# Altium schematic sheet 04_Part-2.SchDoc
size A3; SheetNumber: 4; SheetTotal: 5
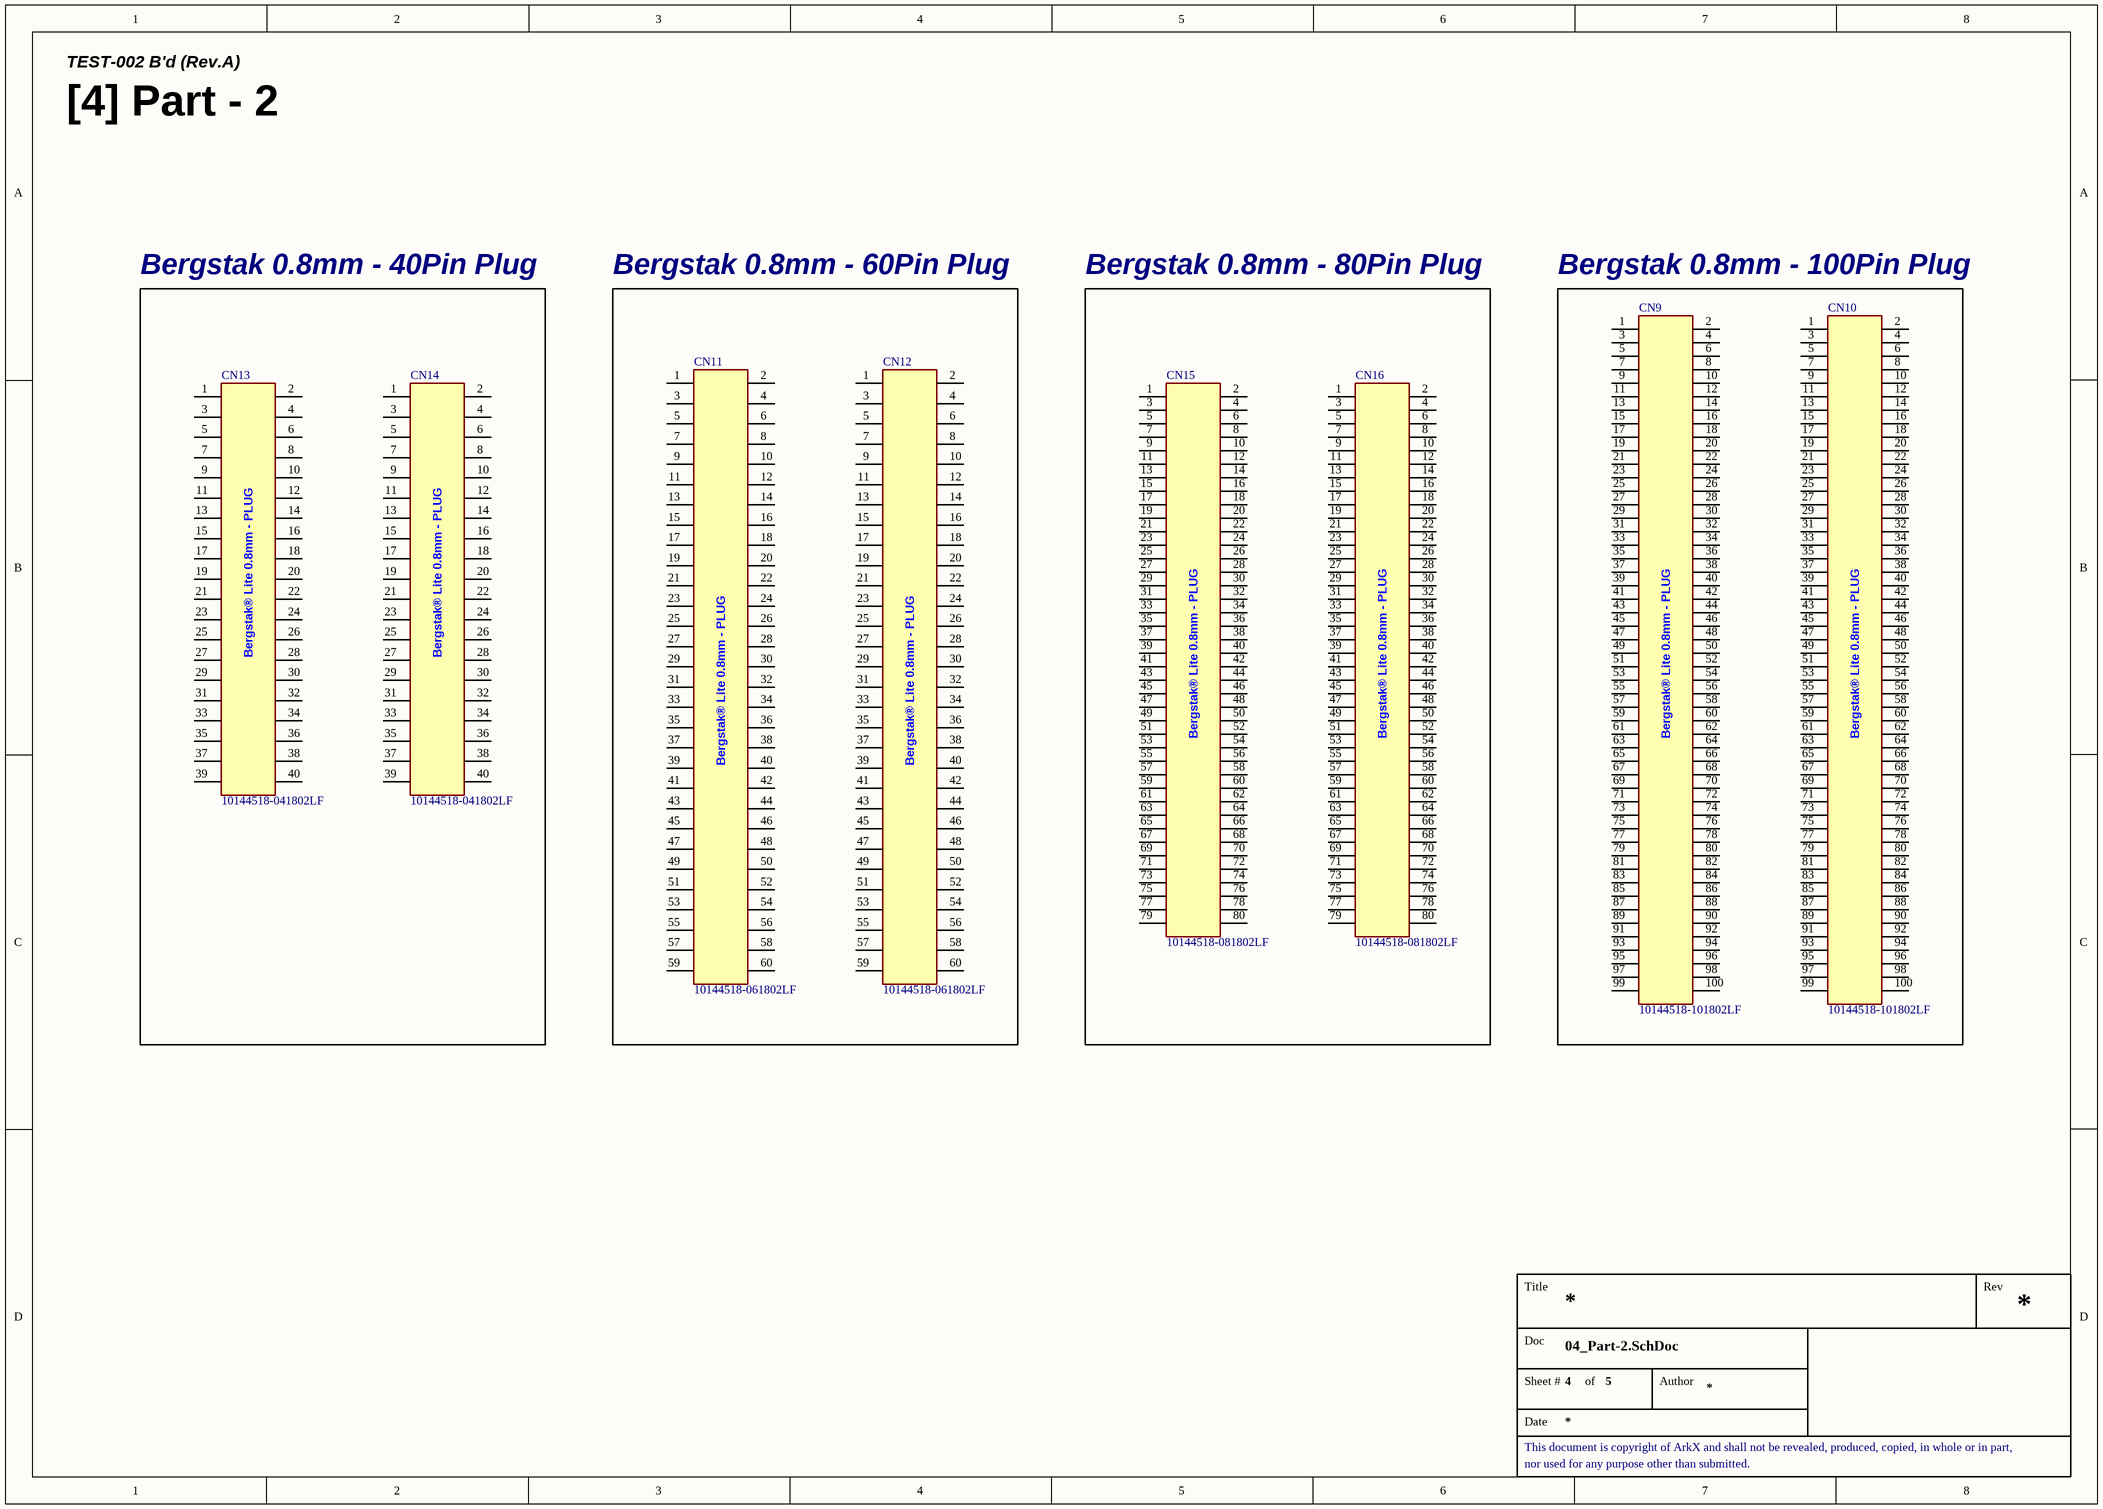
[diagram p0: 04_Part-2.SchDoc]

## Parts
CN9  10144518-101802LF  [CON_BergStak-Lite(0.8mm)_PLUG-100P(10144518-101802LF)_HandSolder]
CN10  10144518-101802LF  [CON_BergStak-Lite(0.8mm)_PLUG-100P(10144518-101802LF)_HandSolder]
CN11  10144518-061802LF  [CON_BergStak-Lite(0.8mm)_PLUG-60P(10144518-061802LF)_HandSolder]
CN12  10144518-061802LF  [CON_BergStak-Lite(0.8mm)_PLUG-60P(10144518-061802LF)_HandSolder]
CN13  10144518-041802LF  [CON_BergStak-Lite(0.8mm)_PLUG-40P(10144518-041802LF)_HandSolder]
CN14  10144518-041802LF  [CON_BergStak-Lite(0.8mm)_PLUG-40P(10144518-041802LF)_HandSolder]
CN15  10144518-081802LF  [CON_BergStak-Lite(0.8mm)_PLUG-80P(10144518-081802LF)_HandSolder]
CN16  10144518-081802LF  [CON_BergStak-Lite(0.8mm)_PLUG-80P(10144518-081802LF)_HandSolder]

## Blocks framed on the sheet
Bergstak 0.8mm - 40Pin Plug: CN13 CN14
Bergstak 0.8mm - 60Pin Plug: CN11 CN12
Bergstak 0.8mm - 80Pin Plug: CN15 CN16
Bergstak 0.8mm - 100Pin Plug: CN9 CN10

## Nets

Not connected (* = marked no-connect by the designer): CN9 1 2 3 4 5 6 7 8 9 10 11 12 13 14 15 16 17 18 19 20 21 22 23 24 25 26 27 28 29 30 31 32 33 34 35 36 37 38 39 40 41 42 43 44 45 46 47 48 49 50 51 52 53 54 55 56 57 58 59 60 61 62 63 64 65 66 67 68 69 70 71 72 73 74 75 76 77 78 79 80 81 82 83 84 85 86 87 88 89 90 91 92 93 94 95 96 97 98 99 100; CN10 1 2 3 4 5 6 7 8 9 10 11 12 13 14 15 16 17 18 19 20 21 22 23 24 25 26 27 28 29 30 31 32 33 34 35 36 37 38 39 40 41 42 43 44 45 46 47 48 49 50 51 52 53 54 55 56 57 58 59 60 61 62 63 64 65 66 67 68 69 70 71 72 73 74 75 76 77 78 79 80 81 82 83 84 85 86 87 88 89 90 91 92 93 94 95 96 97 98 99 100; CN11 1 2 3 4 5 6 7 8 9 10 11 12 13 14 15 16 17 18 19 20 21 22 23 24 25 26 27 28 29 30 31 32 33 34 35 36 37 38 39 40 41 42 43 44 45 46 47 48 49 50 51 52 53 54 55 56 57 58 59 60; CN12 1 2 3 4 5 6 7 8 9 10 11 12 13 14 15 16 17 18 19 20 21 22 23 24 25 26 27 28 29 30 31 32 33 34 35 36 37 38 39 40 41 42 43 44 45 46 47 48 49 50 51 52 53 54 55 56 57 58 59 60; CN13 1 2 3 4 5 6 7 8 9 10 11 12 13 14 15 16 17 18 19 20 21 22 23 24 25 26 27 28 29 30 31 32 33 34 35 36 37 38 39 40; CN14 1 2 3 4 5 6 7 8 9 10 11 12 13 14 15 16 17 18 19 20 21 22 23 24 25 26 27 28 29 30 31 32 33 34 35 36 37 38 39 40; CN15 1 2 3 4 5 6 7 8 9 10 11 12 13 14 15 16 17 18 19 20 21 22 23 24 25 26 27 28 29 30 31 32 33 34 35 36 37 38 39 40 41 42 43 44 45 46 47 48 49 50 51 52 53 54 55 56 57 58 59 60 61 62 63 64 65 66 67 68 69 70 71 72 73 74 75 76 77 78 79 80; CN16 1 2 3 4 5 6 7 8 9 10 11 12 13 14 15 16 17 18 19 20 21 22 23 24 25 26 27 28 29 30 31 32 33 34 35 36 37 38 39 40 41 42 43 44 45 46 47 48 49 50 51 52 53 54 55 56 57 58 59 60 61 62 63 64 65 66 67 68 69 70 71 72 73 74 75 76 77 78 79 80

## Notes on the sheet
- TEST-002 B'd (Rev.A)
- [4] Part - 2
- Title
- Rev
- Doc
- Sheet #
- of
- Author
- This document is copyright of ArkX and shall not be revealed, produced, copied, in whole or in part,
- Date
- nor used for any purpose other than submitted.
- (in symbol CON_BergStak-Lite(0.8mm)_PLUG-40P(10144518-041802LF)) Bergstak® Lite 0.8mm - PLUG
- (in symbol CON_BergStak-Lite(0.8mm)_PLUG-60P(10144518-061802LF)) Bergstak® Lite 0.8mm - PLUG
- (in symbol CON_BergStak-Lite(0.8mm)_PLUG-80P(10144518-081802LF)) Bergstak® Lite 0.8mm - PLUG
- (in symbol CON_BergStak-Lite(0.8mm)_PLUG-100P(10144518-101802LF)) Bergstak® Lite 0.8mm - PLUG

## Library data of the parts
CN9 CN10 = CON_BergStak-Lite(0.8mm)_PLUG-100P(10144518-101802LF): LCSC Part #: C3640067; JLCPCB Part Type: Extended Part
CN11 CN12 = CON_BergStak-Lite(0.8mm)_PLUG-60P(10144518-061802LF): LCSC Part #: C9900003007; JLCPCB Part Type: Extended Part
CN13 CN14 = CON_BergStak-Lite(0.8mm)_PLUG-40P(10144518-041802LF): LCSC Part #: C5410298; JLCPCB Part Type: Extended Part
CN15 CN16 = CON_BergStak-Lite(0.8mm)_PLUG-80P(10144518-081802LF): LCSC Part #: C2889278; JLCPCB Part Type: Extended Part